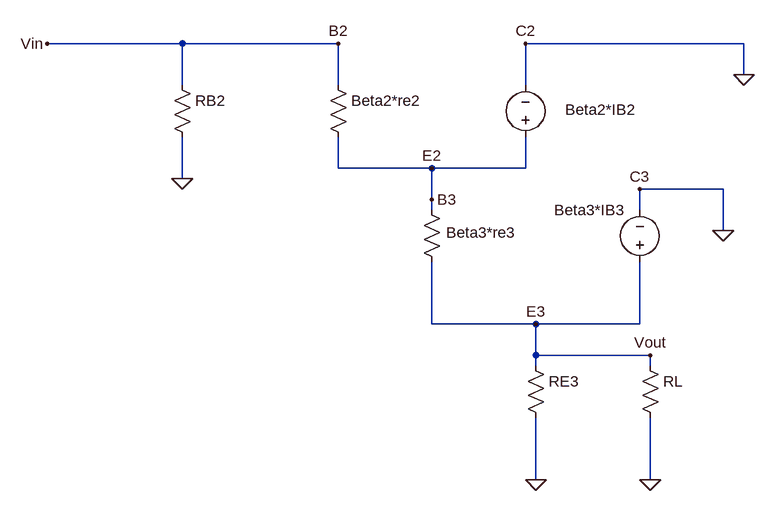
[diagram p0: schematic Draft10.asc]
Draft10.asc, the LTspice schematic file:
Version 4
SHEET 1 980 708
WIRE 96 16 -112 16
WIRE 336 16 96 16
WIRE 960 16 624 16
WIRE 960 64 960 16
WIRE 96 80 96 16
WIRE 336 80 336 16
WIRE 624 80 624 16
WIRE 336 208 336 160
WIRE 480 208 336 208
WIRE 624 208 624 160
WIRE 624 208 480 208
WIRE 96 224 96 160
WIRE 928 240 800 240
WIRE 480 256 480 208
WIRE 480 272 480 256
WIRE 800 272 800 240
WIRE 928 304 928 240
WIRE 480 448 480 352
WIRE 640 448 480 448
WIRE 800 448 800 352
WIRE 800 448 640 448
WIRE 640 496 640 448
WIRE 816 496 640 496
WIRE 640 512 640 496
WIRE 816 512 816 496
WIRE 640 688 640 592
WIRE 816 688 816 592
FLAG 816 688 0
FLAG 640 688 0
FLAG 96 224 0
FLAG 960 64 0
FLAG 928 304 0
FLAG 336 16 B2
FLAG 624 16 C2
FLAG 480 208 E2
FLAG 480 256 B3
FLAG 640 448 E3
FLAG 800 240 C3
FLAG -112 16 Vin
FLAG 816 496 Vout
SYMBOL res 80 64 R0
SYMATTR InstName RB2
SYMATTR Value ""
SYMBOL res 320 64 R0
SYMATTR InstName Beta2*re2
SYMATTR Value ""
SYMBOL voltage 624 176 R180
WINDOW 0 -169 58 Left 2
WINDOW 3 24 16 Left 2
SYMATTR InstName Beta2*IB2
SYMATTR Value ""
SYMBOL res 464 256 R0
WINDOW 0 38 51 Left 2
SYMATTR InstName Beta3*re3
SYMATTR Value ""
SYMBOL voltage 800 368 R180
WINDOW 0 24 96 Left 2
WINDOW 3 24 16 Left 2
SYMATTR InstName Beta3*IB3
SYMATTR Value ""
SYMBOL res 624 496 R0
SYMATTR InstName RE3
SYMATTR Value ""
SYMBOL res 800 496 R0
SYMATTR InstName RL
SYMATTR Value ""

The netlist it stands for:
* Draft10.asc
RB2 Vin 0
R§Beta2*re2 Vin B3
V§Beta2*IB2 B3 0
R§Beta3*re3 B3 Vout
V§Beta3*IB3 Vout 0
RE3 Vout 0
RL Vout 0
.backanno
.end